# Altium schematic sheet [03] - 2560TK_Schematic.SchDoc
size A2; Organization: Altium Limited; Address1: L3, 12a Rodborough Rd; Address2: Frenchs Forest; Address3: NSW; Address4: Australia 2086
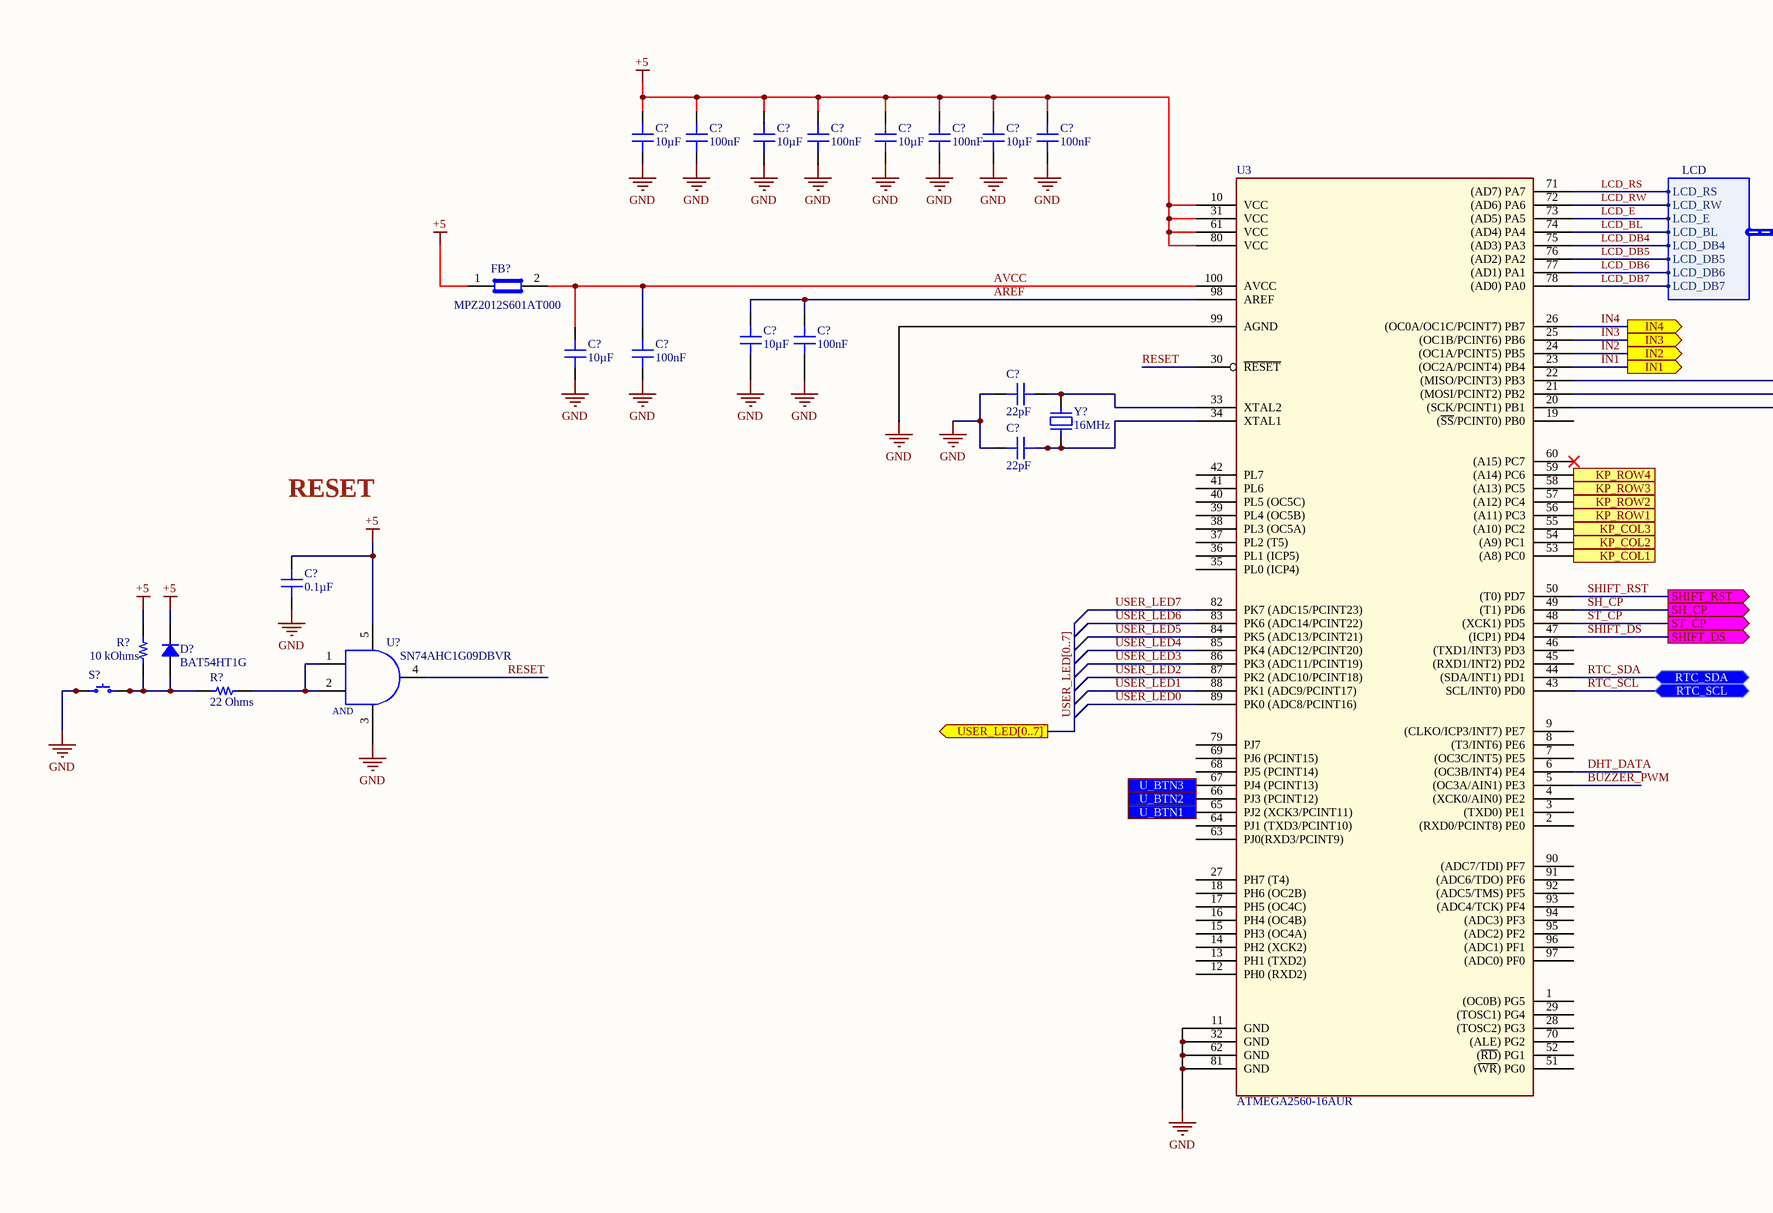
[diagram p0: [03] - 2560TK_Schematic.SchDoc, left]
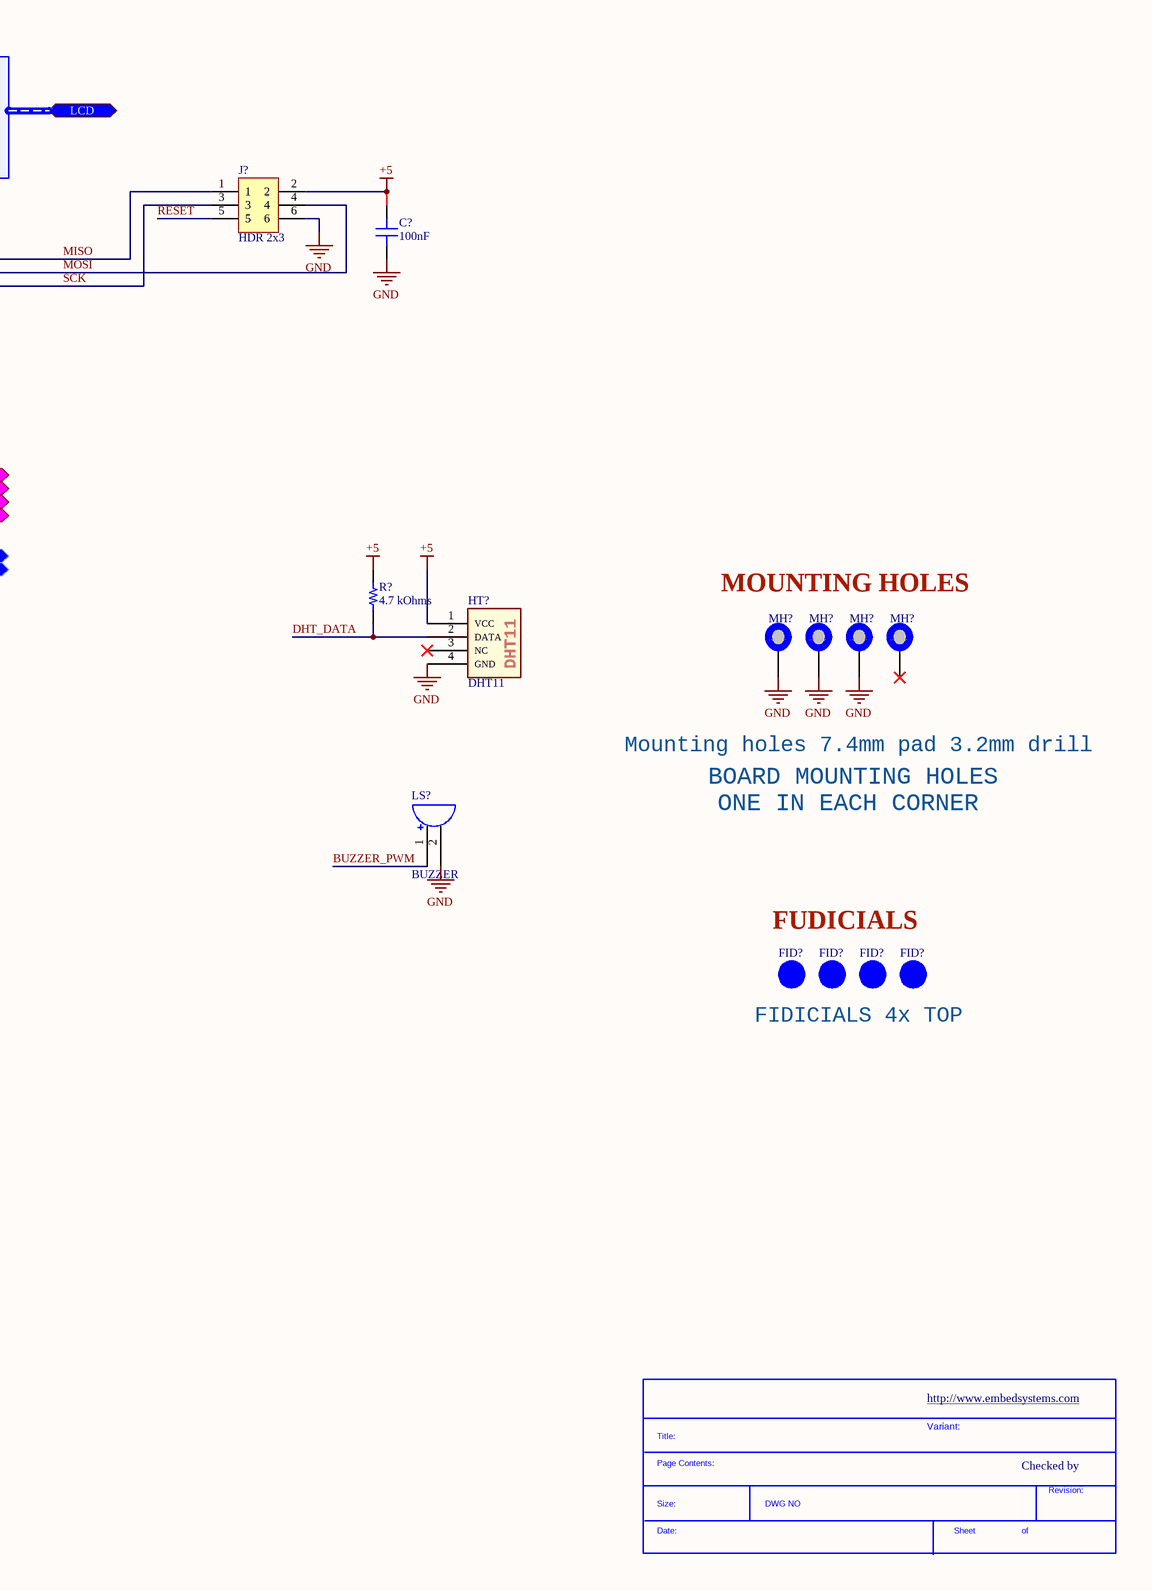
[diagram p1: [03] - 2560TK_Schematic.SchDoc, right]

## Parts
(Parts that share a designator on the sheet are numbered #1, #2 ... from top to bottom, then left to right.)
*?  SDTitleBlock  (value not drawn)  (graphical)
C?#1  10µF  [CAP 0805_2012]
C?#2  100nF  [CAP 0805_2012]
C?#3  10µF  [CAP 0805_2012]
C?#4  100nF  [CAP 0805_2012]
C?#5  10µF  [CAP 0805_2012]
C?#6  100nF  [CAP 0805_2012]
C?#7  10µF  [CAP 0805_2012]
C?#8  100nF  [CAP 0805_2012]
C?#9  10µF  [CAP 0805_2012]
C?#10  100nF  [CAP 0805_2012]
C?#11  10µF  [CAP 0805_2012]
C?#12  100nF  [CAP 0805_2012]
C?#13  100nF  [CAP 0805_2012]
C?#14  22pF  [CAP 0805_2012]
C?#15  22pF  [CAP 0805_2012]
C?#16  0.1µF  [CAP 0805_2012]
D?  BAT54HT1G  [SOD323]
FB?  MPZ2012S601AT000  [C0805]
FID?#1  FID_1MM  [FID_40x120]  (value not drawn)
FID?#2  FID_1MM  [FID_40x120]  (value not drawn)
FID?#3  FID_1MM  [FID_40x120]  (value not drawn)
FID?#4  FID_1MM  [FID_40x120]  (value not drawn)
HT?  DHT11  [DHT11]
J?  HDR 2x3  [HDR_2x3]
LS?  BUZZER  [BUZZER]
MH?#1  MH_7.4MMC_3.2MMD  [MH_7.4MMC_3.2MMD]  (value not drawn)
MH?#2  MH_7.4MMC_3.2MMD  [MH_7.4MMC_3.2MMD]  (value not drawn)
MH?#3  MH_7.4MMC_3.2MMD  [MH_7.4MMC_3.2MMD]  (value not drawn)
MH?#4  MH_7.4MMNC_3.2MMD  [MH_7.4MM_3.2MMD_NON_COPPER_NPTH]  (value not drawn)
R?#1  10 kOhms  [RES 0805_2012]
R?#2  22 Ohms  [RES 0805_2012]
R?#3  4.7 kOhms  [RES 0805_2012]
S?  PTS645SM43SMTR92 LFS  [C&K PTS645]  (value not drawn)
U3  ATMEGA2560-16AUR  [100pinTQFP]
U?  SN74AHC1G09DBVR  [DBV_SOP_23_5]
Y?  16MHz  [ABRACON ABLS]

## Ports
IN1 (out), IN2 (out), IN3 (out), IN4 (out), KP_COL1 (out), KP_COL2 (out), KP_COL3 (out), KP_ROW1 (in), KP_ROW2 (in), KP_ROW3 (in), KP_ROW4 (in), LCD (bidir, harness LCD), RTC_SCL (bidir), RTC_SDA (bidir), SH_CP (out), SHIFT_DS (out), SHIFT_RST (out), ST_CP (out), U_BTN1 (in), U_BTN2 (in), U_BTN3 (in), USER_LED[0..7] (out)

## Harnesses
LCD: LCD_RS, LCD_RW, LCD_E, LCD_BL, LCD_DB4, LCD_DB5, LCD_DB6, LCD_DB7

## Nets
+5: C?#1.2 C?#2.2 C?#3.2 C?#4.2 C?#5.2 C?#6.2 C?#7.2 C?#8.2 C?#13.2 C?#16.2 D?.2 FB?.1 HT?.1(VCC) J?.2 R?#1.2 R?#3.2 U3.10(VCC) U3.31(VCC) U3.61(VCC) U3.80(VCC) U?.5
GND: C?#1.1 C?#2.1 C?#3.1 C?#4.1 C?#5.1 C?#6.1 C?#7.1 C?#8.1 C?#9.1 C?#10.1 C?#11.1 C?#12.1 C?#13.1 C?#14.1 C?#15.1 C?#16.1 HT?.4(GND) J?.6 LS?.2 MH?#1.1 MH?#2.1 MH?#3.1 S?.1 S?.2 U3.11(GND) U3.32(GND) U3.62(GND) U3.81(GND) U3.99(AGND) U?.3
AREF: C?#9.2 C?#10.2 U3.98(AREF)
AVCC: C?#11.2 C?#12.2 FB?.2 U3.100(AVCC)
BUZZER_PWM: LS?.1 U3.5((OC3A/AIN1)_PE3)
DHT_DATA: HT?.2(DATA) R?#3.1 U3.6((OC3B/INT4)_PE4)
IN1: U3.23((OC2A/PCINT4)_PB4) ; port IN1
IN2: U3.24((OC1A/PCINT5)_PB5) ; port IN2
IN3: U3.25((OC1B/PCINT6)_PB6) ; port IN3
IN4: U3.26((OC0A/OC1C/PCINT7)_PB7) ; port IN4
KP_COL1: U3.53((A8)_PC0) ; port KP_COL1
KP_COL2: U3.54((A9)_PC1) ; port KP_COL2
KP_COL3: U3.55((A10)_PC2) ; port KP_COL3
KP_ROW1: U3.56((A11)_PC3) ; port KP_ROW1
KP_ROW2: U3.57((A12)_PC4) ; port KP_ROW2
KP_ROW3: U3.58((A13)_PC5) ; port KP_ROW3
KP_ROW4: U3.59((A14)_PC6) ; port KP_ROW4
LCD_BL: U3.74((AD4)_PA4) ; port LCD.LCD_BL
LCD_DB4: U3.75((AD3)_PA3) ; port LCD.LCD_DB4
LCD_DB5: U3.76((AD2)_PA2) ; port LCD.LCD_DB5
LCD_DB6: U3.77((AD1)_PA1) ; port LCD.LCD_DB6
LCD_DB7: U3.78((AD0)_PA0) ; port LCD.LCD_DB7
LCD_E: U3.73((AD5)_PA5) ; port LCD.LCD_E
LCD_RS: U3.71((AD7)_PA7) ; port LCD.LCD_RS
LCD_RW: U3.72((AD6)_PA6) ; port LCD.LCD_RW
MISO: J?.1 U3.22((MISO/PCINT3)_PB3)
MOSI: J?.4 U3.21((MOSI/PCINT2)_PB2)
RESET: J?.5 U3.30(~{RESET}) U?.4
RTC_SCL: U3.43(SCL/INT0)_PD0) ; port RTC_SCL
RTC_SDA: U3.44((SDA/INT1)_PD1) ; port RTC_SDA
SCK: J?.3 U3.20((SCK/PCINT1)_PB1)
SH_CP: U3.49((T1)_PD6) ; port SH_CP
SHIFT_DS: U3.47((ICP1)_PD4) ; port SHIFT_DS
SHIFT_RST: U3.50((T0)_PD7) ; port SHIFT_RST
ST_CP: U3.48((XCK1)_PD5) ; port ST_CP
U_BTN1: U3.65(PJ2_(XCK3/PCINT11)) ; port U_BTN1
U_BTN2: U3.66(PJ3_(PCINT12)) ; port U_BTN2
U_BTN3: U3.67(PJ4_(PCINT13)) ; port U_BTN3
USER_LED0: U3.89(PK0_(ADC8/PCINT16))
USER_LED1: U3.88(PK1_(ADC9/PCINT17))
USER_LED2: U3.87(PK2_(ADC10/PCINT18))
USER_LED3: U3.86(PK3_(ADC11/PCINT19))
USER_LED4: U3.85(PK4_(ADC12/PCINT20))
USER_LED5: U3.84(PK5_(ADC13/PCINT21))
USER_LED6: U3.83(PK6_(ADC14/PCINT22))
USER_LED7: U3.82(PK7_(ADC15/PCINT23))
NetC?#14_2: C?#14.2 U3.33(XTAL2) Y?.2
NetC?#15_2: C?#15.2 U3.34(XTAL1) Y?.1
NetD?_1: D?.1 R?#1.1 R?#2.1 S?.3 S?.4
NetR?#2_2: R?#2.2 U?.1 U?.2

Not connected (* = marked no-connect by the designer): HT? 3(NC)*; MH?#4 1*; U3 1((OC0B)_PG5) 2((RXD0/PCINT8)_PE0) 3((TXD0)_PE1) 4((XCK0/AIN0)_PE2) 7((OC3C/INT5)_PE5) 8((T3/INT6)_PE6) 9((CLKO/ICP3/INT7)_PE7) 12(PH0_(RXD2)) 13(PH1_(TXD2)) 14(PH2_(XCK2)) 15(PH3_(OC4A)) 16(PH4_(OC4B)) 17(PH5_(OC4C)) 18(PH6_(OC2B)) 19((~{SS}/PCINT0)_PB0) 27(PH7_(T4)) 28((TOSC2)_PG3) 29((TOSC1)_PG4) 35(PL0_(ICP4)) 36(PL1_(ICP5)) 37(PL2_(T5)) 38(PL3_(OC5A)) 39(PL4_(OC5B)) 40(PL5_(OC5C)) 41(PL6) 42(PL7) 45((RXD1/INT2)_PD2) 46((TXD1/INT3)_PD3) 51((~{WR})_PG0) 52((~{RD})_PG1) 60((A15)_PC7)* 63(PJ0(RXD3/PCINT9)) 64(PJ1_(TXD3/PCINT10)) 68(PJ5_(PCINT14)) 69(PJ6_(PCINT15)) 70((ALE)_PG2) 79(PJ7) 90((ADC7/TDI)_PF7) 91((ADC6/TDO)_PF6) 92((ADC5/TMS)_PF5) 93((ADC4/TCK)_PF4) 94((ADC3)_PF3) 95((ADC2)_PF2) 96((ADC1)_PF1) 97((ADC0)_PF0)

## Buses and harness runs
bus USER_LED[0..7] = port USER_LED[0..7]

## Notes on the sheet
- RESET
- (near MH?#1) MOUNTING HOLES
- Mounting holes 7.4mm pad 3.2mm drill
- ONE IN EACH CORNER
- BOARD MOUNTING HOLES
- (near FID?#1) FUDICIALS
- (near FID?#1) FIDICIALS 4x TOP
- http://www.embedsystems.com
- Variant:
- Checked by
- Title
- Size:
- Date:
- File:
- A2
- Number:
- Time:
- Revision:
- Sheet
- of
- (in symbol SDTitleBlock) Title:; Page Contents:; Revision:; Size:; DWG NO; Date:; Sheet; of
- (in symbol SN74AHC1G09DBVR) AND

## Library data of the parts
C?#1 C?#3 C?#5 C?#7 C?#9 C?#11 = 0805BW106K160NGT: CAP CER 10UF 16V X5R 0805; Manufacturer: Knowles Novacap; Tolerance: ±10%; Part Number: 0805BW106K160NGT; Value: 10µF; Applications: General Purpose; Capacitance: 10µF; ComponentLink1Description: Datasheet; ComponentLink1URL: https://www.knowlescapacitors.com/getattachment/6c8d48ef-fc2b-4752-ae2c-ce6c208de0c4/High-Capacitance-Chip.aspx; ComponentLink2Description: DigiKey Link; ComponentLink2URL: http://digikey.com/product-detail/en/knowles-novacap/0805BW106K160NGT/1763-1170-1-ND/7303990; Device Package: 0805 (2012 Metric); Features: Gold Flash Termination; LastUpdated: 02/09/2020 01:04:27; Lifecycle Status: Active; Minimum Order: 1; Mounting Type: Surface Mount, MLCC; Operating Temperature: -55°C ~ 85°C; Package / Case: 0805 (2012 Metric); Packaging: TapeAndReel; PartId: 10571; Part Status: Active; Price: 1.32; Series: -; Size / Dimension: 0.080" L x 0.050" W (2.03mm x 1.27mm); Supplier 1: DigiKey; Supplier Part Number 1: 1763-1170-1-ND; Temperature Coefficient: X5R; Thickness (Max): 0.054" (1.37mm); Voltage - Rated: 16V
C?#2 C?#4 C?#6 C?#8 C?#10 C?#12 C?#13 = AC0805KKX8R9BB104: CAP CER 0805 10% X8R 50V 100NF; Manufacturer: Yageo; Capacitance: 0.1µF; Part Number: AC0805KKX8R9BB104; Value: 100nF; Applications: Automotive; ComponentLink1Description: Datasheet; ComponentLink1URL: http://www.yageo.com/documents/recent/AC0805KKX8R9BB104.pdf; ComponentLink2Description: DigiKey Link; ComponentLink2URL: http://digikey.com/product-detail/en/yageo/AC0805KKX8R9BB104/311-4624-1-ND/9699550; Device Package: 0805 (2012 Metric); LastUpdated: 02/09/2020 01:04:20; Lifecycle Status: Active; Minimum Order: 1; Mounting Type: Surface Mount, MLCC; Operating Temperature: -55°C ~ 150°C; Package / Case: 0805 (2012 Metric); Packaging: TapeAndReel; PartId: 14076; Part Status: Active; Price: 0.06; Ratings: AEC-Q200; Series: AC; Size / Dimension: 0.079" L x 0.049" W (2.00mm x 1.25mm); Supplier 1: DigiKey; Supplier Part Number 1: 311-4624-1-ND; Temperature Coefficient: X8R; Thickness (Max): 0.057" (1.45mm); Tolerance: ±10%; Voltage - Rated: 50V
C?#14 C?#15 = 08051A220GAT2A: CAP CER 22PF 100V C0G/NP0 0805; Manufacturer: AVX Corporation; Temperature Coefficient: C0G, NP0; Tolerance: ±2%; Part Number: 08051A220GAT2A; Value: 22pF; Applications: General Purpose; Capacitance: 22pF; ComponentLink1Description: Datasheet; ComponentLink1URL: http://datasheets.avx.com/C0GNP0-Dielectric.pdf; ComponentLink2Description: DigiKey Link; ComponentLink2URL: http://digikey.com/product-detail/en/avx-corporation/08051A220GAT2A/478-10819-1-ND/7536356; Device Package: 0805 (2012 Metric); LastUpdated: 02/09/2020 01:04:39; Lifecycle Status: Active; Minimum Order: 1; Mounting Type: Surface Mount, MLCC; Operating Temperature: -55°C ~ 125°C; Package / Case: 0805 (2012 Metric); Packaging: TapeAndReel; PartId: 3991; Part Status: Active; Price: 0.10; Series: -; Size / Dimension: 0.079" L x 0.049" W (2.01mm x 1.25mm); Supplier 1: DigiKey; Supplier Part Number 1: 478-10819-1-ND; Thickness (Max): 0.037" (0.94mm); Voltage - Rated: 100V
C?#16 = AC0805KKX8R9BB104: CAP CER 0805 10% X8R 50V 100NF; Manufacturer: Yageo; Part Number: AC0805KKX8R9BB104; Value: 0.1µF; Applications: Automotive; Capacitance: 0.1µF; ComponentLink1Description: Datasheet; ComponentLink1URL: http://www.yageo.com/documents/recent/AC0805KKX8R9BB104.pdf; ComponentLink2Description: DigiKey Link; ComponentLink2URL: http://digikey.com/product-detail/en/yageo/AC0805KKX8R9BB104/311-4624-1-ND/9699550; Device Package: 0805 (2012 Metric); LastUpdated: 02/09/2020 01:04:20; Lifecycle Status: Active; Minimum Order: 1; Mounting Type: Surface Mount, MLCC; Operating Temperature: -55°C ~ 150°C; Package / Case: 0805 (2012 Metric); Packaging: TapeAndReel; PartId: 14076; Part Status: Active; Price: 0.06; Ratings: AEC-Q200; Series: AC; Size / Dimension: 0.079" L x 0.049" W (2.00mm x 1.25mm); Supplier 1: DigiKey; Supplier Part Number 1: 311-4624-1-ND; Temperature Coefficient: X8R; Thickness (Max): 0.057" (1.45mm); Tolerance: ±10%; Voltage - Rated: 50V
D? = BAT54HT1G: DIODE SCHOTTKY 30V 200MA SOD323; Manufacturer: ON Semiconductor; Capacitance @ Vr, F: 10pF @ 1V, 1MHz; Current - Average Rectified (Io): 200mA (DC); Current - Reverse Leakage @ Vr: 2µA @ 25V; Reverse Recovery Time (trr): 5ns; Speed: Small Signal =< 200mA (Io), Any Speed; Voltage - Forward (Vf) (Max) @ If: 800mV @ 100mA; Part Number: BAT54HT1G; ComponentLink1Description: Datasheet; ComponentLink1URL: //media.digikey.com/pdf/Data%20Sheets/Fairchild%20PDFs/BAT54HT1G_Rev_1.2.pdf; ComponentLink2Description: DigiKey Link; ComponentLink2URL: http://digikey.com/product-detail/en/on-semiconductor/BAT54HT1G/BAT54HT1GOSCT-ND/917809; Diode Type: Schottky; LastUpdated: 02/09/2020 01:27:26; Lifecycle Status: Active; Minimum Order: 1; Mounting Type: Surface Mount; Operating Temperature - Junction: -55°C ~ 150°C; Package / Case: SC-76, SOD-323; Packaging: TapeAndReel; PartId: 3080; Part Status: Active; Price: 0.03; Supplier 1: DigiKey; Supplier Part Number 1: BAT54HT1GOSCT-ND; Supplier Device Package: SOD-323; Voltage - DC Reverse (Vr) (Max): 30V
FB? = MPZ2012S601AT000: FERRITE BEAD 600 OHM 0805 1LN; Manufacturer: TDK; Impedance: 600R; Current Rating: 2A; DC Resistance (DCR): 100mR; Supplier 1: Digi-Key; Manufacturer Part Number: MPZ2012S601AT000; RoHS: Yes; Category: Ferrite Beads and Chips; Stock 1: 209203; Pricing 1: 1=0.11000, 10=0.09200, 25=0.08240, 50=0.06040, 100=0.05220, 250=0.04116, 500=0.03476, 1000=0.02928 (USD); Mount: Surface Mount; Case/Package: 0805; Case Code (Metric): 2012; Case Code (Imperial): 0805; Packaging: Tape and Reel; Package Quantity: 1; Max DC Current: 2A; Series: MPZ; Length: 0.079inch; Width: 0.049inch; Height: 0.041inch; REACH SVHC: No SVHC; Lead Free: Lead Free; RoHS Compliant: Yes; ComponentLink1URL: https://datasheet.ciiva.com/46634/beads-commercial-power-mpz-en-46634377.pdf?src-supplier=Digi-Key; ComponentLink1Description: https://datasheet.ciiva.com/46634/beads-commercial-power-mpz-en-46634377.pdf?src-supplier=Digi-Key; ComponentLink2URL: https://datasheet.ciiva.com/46634/beads-commercial-power-mpz-en-46634606.pdf?src-supplier=Digi-Key; ComponentLink2Description: https://datasheet.ciiva.com/46634/beads-commercial-power-mpz-en-46634606.pdf?src-supplier=Digi-Key; ComponentLink3URL: https://datasheet.ciiva.com/46634/beads-commercial-power-mpz-en-46634335.pdf?src-supplier=Digi-Key; ComponentLink3Description: https://datasheet.ciiva.com/46634/beads-commercial-power-mpz-en-46634335.pdf?src-supplier=Digi-Key; Supplier Part Number 1: 445-2206-1-ND
FID?#1-FID?#4 = FID_1MM: Fiducial 40mil Diameter, 120mil mask
HT? = DHT11: SENSOR HUMID/TEMP 5V DTL 5% MOD; Manufacturer: Adafruit Industries; Manufacturer Part Number: 386; Response Time: 1s; Sensor Type: Temperature; Output Type: Digital; RoHS: Yes; Category: Optoelectronics; Stock 1: 753; Pricing 1: 1=5.00000 (USD); Mount: Chassis Mount; Min Operating Temperature: 0°C; Max Operating Temperature: 50°C; Accuracy: 5%; ComponentLink1URL: https://media.digikey.com/pdf/Data%20Sheets/Adafruit%20PDFs/DHT11_ProdManual.pdf?src-supplier=Digi-Key; ComponentLink1Description: https://media.digikey.com/pdf/Data%20Sheets/Adafruit%20PDFs/DHT11_ProdManual.pdf?src-supplier=Digi-Key; Supplier 1: Digi-Key; Supplier Part Number 1: 1528-1228-ND
J? = HDR 2x3: CONN HEADER 6POS .100 STR 30AU; Manufacturer: Amphenol FCI; Manufacturer Part Number: 67997-106HLF; Number of Contacts: 6; Current Rating: 3A; Voltage Rating: 1.5kV; Insulation Resistance: 5GR; Gender: Male; Connector Type: Male Pin; Pitch: 2.54mm; Row Spacing: 0.1inch; Contact Post Length: 3.05mm; Supplier 1: Digi-Key; RoHS: Yes; Category: Headers and Wire Housings; Stock 1: 1173; Pricing 1: 1=1.87000, 10=1.69500, 100=1.45300, 500=1.21082, 1000=1.03785, 5000=0.92023, 10000=0.89947 (USD); Mount: Through Hole; Contact Plating: Gold,GXT; Contact Material: Bronze; Color: Black; Housing Color: Black; Housing Material: Thermoplastic; Min Operating Temperature: -65°C; Max Operating Temperature: 125°C; Number of Rows: 2; Termination: Through Hole; Packaging: Bulk; Package Quantity: 100; Contact Gender: Male; Number of Positions: 6; Max Voltage Rating (AC): 1.5kV; Orientation: Straight; Series: 67997; Contact Type: Male Pin; Length: 7.62mm; Contact Mating Length: 0.23inch; Depth: 4.83mm; Radiation Hardening: No; REACH SVHC: No SVHC; Lead Free: Lead Free; Flammability Rating: UL94 V-0; RoHS Compliant: Yes; ComponentLink1URL: https://datasheet.ciiva.com/5153/67996-222463-5153820.pdf?src-supplier=Mouser; ComponentLink1Description: https://datasheet.ciiva.com/5153/67996-222463-5153820.pdf?src-supplier=Mouser; ComponentLink2URL: https://datasheet.ciiva.com/16726/67996-16726286.pdf?src-supplier=Avnet+Europe; ComponentLink2Description: https://datasheet.ciiva.com/16726/67996-16726286.pdf?src-supplier=Avnet+Europe; ComponentLink3URL: https://datasheet.ciiva.com/722/67996-722044.pdf?src-supplier=Digi-Key; ComponentLink3Description: https://datasheet.ciiva.com/722/67996-722044.pdf?src-supplier=Digi-Key; ComponentLink4URL: https://datasheet.ciiva.com/10149/67996-10149221.pdf?src-supplier=Avnet; ComponentLink4Description: https://datasheet.ciiva.com/10149/67996-10149221.pdf?src-supplier=Avnet; ComponentLink5URL: https://datasheet.ciiva.com/46393/1876884-46393067.pdf?src-supplier=Element14; ComponentLink5Description: https://datasheet.ciiva.com/46393/1876884-46393067.pdf?src-supplier=Element14; Supplier Part Number 1: 609-3393-ND
LS? = BUZZER: AUDIO MAGNETIC XDCR 3-7V TH; Manufacturer: Projects Unlimited; Manufacturer Part Number: AT-1224-TWT-5V-2-R; Voltage Rating: 5V; Frequency: 2.4kHz; Operating Supply Current: 40mA; RoHS: Yes; Category: Audio Products; Stock 1: 83564; Pricing 1: 1=0.61000, 5=0.54600, 10=0.52000, 25=0.48640, 50=0.46120, 100=0.43680, 500=0.38252, 1000=0.36032, 5000=0.31168 (USD); Mount: Through Hole; Contact Plating: Tin; Min Operating Temperature: -30°C; Max Operating Temperature: 70°C; Packaging: Tray; Termination: PC Pins; Sensing Method: Magnetic; Max Supply Current: 40mA; Diameter: 12mm; Height: 9mm; ComponentLink1URL: http://www.mouser.com/ds/2/334/AT-1224-TWT-5V-2-R-532234.pdf?src-supplier=Mouser; ComponentLink1Description: http://www.mouser.com/ds/2/334/AT-1224-TWT-5V-2-R-532234.pdf?src-supplier=Mouser; ComponentLink2URL: http://www.puiaudio.com/pdf/AT-1224-TWT-5V-2-R.pdf?src-supplier=Digi-Key; ComponentLink2Description: http://www.puiaudio.com/pdf/AT-1224-TWT-5V-2-R.pdf?src-supplier=Digi-Key; ComponentLink3URL: http://www.puiaudio.com/pdf/AT-1224-TWT-5V-2-R.pdf?src-supplier=Avnet; ComponentLink3Description: http://www.puiaudio.com/pdf/AT-1224-TWT-5V-2-R.pdf?src-supplier=Avnet; Supplier 1: Digi-Key; Supplier Part Number 1: 668-1470-ND
MH?#1-MH?#3 = MH_7.4MMC_3.2MMD: Mounting Hole 7.4mm Diameter, 3.2mm Dril
MH?#4 = MH_7.4MMNC_3.2MMD: Mounting Hole 7.4mm Diameter (Non Copper), 3.2mm Dril NPTH
R?#1 = RT0805DRD0710KL: RES SMD 10K OHM 0.5% 1/8W 0805; Manufacturer: Yageo; Power (Watts): 0.125W, 1/8W; Temperature Coefficient: ±25ppm/°C; Part Number: RT0805DRD0710KL; Value: 10 kOhms; ComponentLink1Description: Datasheet; ComponentLink1URL: https://www.yageo.com/upload/media/product/productsearch/datasheet/rchip/PYu-RT_1-to-0.01_RoHS_L_11.pdf; ComponentLink2Description: DigiKey Link; ComponentLink2URL: http://digikey.com/product-detail/en/yageo/RT0805DRD0710KL/311-2699-1-ND/6129118; Composition: Thin Film; Device Package: 0805 (2012 Metric); Height - Seated (Max): 0.024" (0.60mm); LastUpdated: 02/09/2020 01:15:24; Lifecycle Status: Active; Minimum Order: 1; Number of Terminations: 2; Operating Temperature: -55°C ~ 155°C; Package / Case: 0805 (2012 Metric); Packaging: TapeAndReel; PartId: 27797; Part Status: Active; Price: 0.03; Resistance: 10 kOhms; Series: RT; Size / Dimension: 0.079" L x 0.049" W (2.00mm x 1.25mm); Supplier 1: DigiKey; Supplier Part Number 1: 311-2699-1-ND; Supplier Device Package: 0805; Tolerance: ±0.5%
R?#2 = RC0805JR-0722RL: RES SMD 22 OHM 5% 1/8W 0805; Manufacturer: Yageo; Power (Watts): 0.125W, 1/8W; Temperature Coefficient: ±100ppm/°C; Part Number: RC0805JR-0722RL; Value: 22 Ohms; ComponentLink1Description: Datasheet; ComponentLink1URL: https://www.yageo.com/upload/media/product/productsearch/datasheet/rchip/PYu-RC_Group_51_RoHS_L_10.pdf; ComponentLink2Description: DigiKey Link; ComponentLink2URL: http://digikey.com/product-detail/en/yageo/RC0805JR-0722RL/311-22ARCT-ND/731232; Composition: Thick Film; Device Package: 0805 (2012 Metric); Features: Moisture Resistant; Height - Seated (Max): 0.024" (0.60mm); LastUpdated: 02/09/2020 01:14:53; Lifecycle Status: Active; Minimum Order: 1; Number of Terminations: 2; Operating Temperature: -55°C ~ 155°C; Package / Case: 0805 (2012 Metric); Packaging: CutTape; PartId: 41770; Part Status: Active; Price: 0.10; Resistance: 22 Ohms; Series: RC; Size / Dimension: 0.079" L x 0.049" W (2.00mm x 1.25mm); Supplier 1: DigiKey; Supplier Part Number 1: 311-22ARCT-ND; Supplier Device Package: 0805; Tolerance: ±5%
R?#3 = RC0805FR-074K7P: RES SMD 4.7K OHM 1% 1/8W 0805; Manufacturer: Yageo; Power (Watts): 0.125W, 1/8W; Temperature Coefficient: ±100ppm/°C; Part Number: RC0805FR-074K7P; Value: 4.7 kOhms; ComponentLink1Description: Datasheet; ComponentLink1URL: http://www.yageo.com/NewPortal/yageodocoutput?fileName=/pdf/R-Chip/PYu-RC_51_RoHS_P_0.pdf; ComponentLink2Description: DigiKey Link; ComponentLink2URL: http://digikey.com/product-detail/en/yageo/RC0805FR-074K7P/YAG1325CT-ND/4935438; Composition: Thick Film; Device Package: 0805 (2012 Metric); Features: Moisture Resistant; Height - Seated (Max): 0.024" (0.60mm); LastUpdated: 02/09/2020 01:15:24; Lifecycle Status: Active; Minimum Order: 1; Number of Terminations: 2; Operating Temperature: -55°C ~ 155°C; Package / Case: 0805 (2012 Metric); Packaging: TapeAndReel; PartId: 27895; Part Status: Active; Price: 0.01; Resistance: 4.7 kOhms; Series: RC-P Lead Free; Size / Dimension: 0.079" L x 0.049" W (2.00mm x 1.25mm); Supplier 1: DigiKey; Supplier Part Number 1: YAG1325CT-ND; Supplier Device Package: 0805; Tolerance: ±1%
S? = PTS645SM43SMTR92 LFS: SWITCH TACTILE SPST-NO 0.05A 12V; Manufacturer: C&K; Actuator Height off PCB, Vertical: 4.30mm; Actuator Orientation: Top Actuated; Actuator Type: Standard; Contact Rating @ Voltage: 0.05A @ 12VDC; Illumination: Non-Illuminated; Operating Force: 160gf; Outline: 6.00mm x 6.00mm; Switch Function: Off-Mom; Part Number: PTS645SM43SMTR92 LFS; Circuit: SPST-NO; ComponentLink1Description: Datasheet; ComponentLink1URL: https://dznh3ojzb2azq.cloudfront.net/products/Tactile/PTS645/documents/datasheet.pdf; ComponentLink2Description: DigiKey Link; ComponentLink2URL: http://digikey.com/product-detail/en/c-k/PTS645SM43SMTR92-LFS/CKN9112CT-ND/1146934; Features: Blue Actuator; LastUpdated: 09/04/2020 09:59:00; Lifecycle Status: Active; Minimum Order: 1; Mounting Type: Surface Mount; Operating Temperature: -20°C ~ 60°C; Packaging: TapeAndReel; Part Status: Active; Price: 0.09; Series: PTS645; Supplier 1: DigiKey; Supplier Part Number 1: CKN9112CT-ND; Termination Style: Gull Wing
U3 = ATMEGA2560-16AUR: ATMEGA2560 IC MCU 8BIT 256KB FLASH 100TQFP; Manufacturer: Microchip / Atmel; RAM Size: 8KB; Interface: I2C,SPI,UART,USART,EBI/EMI; Number of I/Os: 86; Number of Timers/Counters: 6; Frequency: 16MHz; Operating Supply Voltage: 5V; Max Supply Voltage: 5.5V; Min Supply Voltage: 4.5V; Oscillator Type: Internal; Data Bus Width: 8b; Watchdog Timer: Yes; Peripherals: Brown-out Detect/Reset,POR,PWM,WDT; Core Architecture: AVR; Supplier 1: Digi-Key; Manufacturer Part Number: ATMEGA2560-16AUR; RoHS: Yes; Category: Microcontrollers; Stock 1: 900; Pricing 1: 1=11.99000, 25=10.99000, 100=9.95010 (USD); Mount: Surface Mount; Case/Package: A; Number of Pins: 100; Contact Plating: Tin,Matte; Min Operating Temperature: -40°C; Max Operating Temperature: 85°C; Package Quantity: 1500; Packaging: Tape and Reel; Number of Programmable I/O: 86; Max Frequency: 16MHz; Memory Type: FLASH; Memory Size: 256KB; REACH SVHC: No SVHC; Lead Free: Lead Free; ComponentLink1URL: https://datasheet.ciiva.com/6641/atmel-2549-8-bit-avr-microcontroller-atmega640-1280-1281-2560-2561-summary-6641242.pdf?src-supplier=Digi-Key; ComponentLink1Description: https://datasheet.ciiva.com/6641/atmel-2549-8-bit-avr-microcontroller-atmega640-1280-1281-2560-2561-summary-6641242.pdf?src-supplier=Digi-Key; ComponentLink2URL: https://datasheet.ciiva.com/6641/atmel-2549-8-bit-avr-microcontroller-atmega640-1280-1281-2560-2561-summary-6641243.pdf?src-supplier=Digi-Key; ComponentLink2Description: https://datasheet.ciiva.com/6641/atmel-2549-8-bit-avr-microcontroller-atmega640-1280-1281-2560-2561-summary-6641243.pdf?src-supplier=Digi-Key; ComponentLink3URL: https://datasheet.ciiva.com/6641/atmel-2549-8-bit-avr-microcontroller-atmega640-1280-1281-2560-2561-summary-6641244.pdf?src-supplier=Digi-Key; ComponentLink3Description: https://datasheet.ciiva.com/6641/atmel-2549-8-bit-avr-microcontroller-atmega640-1280-1281-2560-2561-summary-6641244.pdf?src-supplier=Digi-Key; Supplier Part Number 1: ATMEGA2560-16AURCT-ND
U? = SN74AHC1G09DBVR: TEXAS INSTRUMENTS - SN74AHC1G09DBVR - AND Gate, 74AHC1G09, 2 Input, 2 V to 5.5 V, SOT-23-5; Min Supply Voltage: 2V; Max Supply Voltage: 5.5V; Quiescent Current: 1uA; Number of Inputs: 2; Propagation Delay: 7.5ns; Output Current: 25mA; Number of Circuits: 1; Low Level Output Current: 8mA; Supplier 1: Digi-Key; Manufacturer: Texas Instruments; Manufacturer Part Number: SN74AHC1G09DBVR; RoHS: Yes; Category: Logic Gates; Stock 1: 8299; Pricing 1: 1=0.36000, 10=0.27100, 25=0.23760, 100=0.15370, 250=0.12720, 500=0.10176, 1000=0.07802 (USD); Mount: Surface Mount; Case/Package: SOT-23; Number of Pins: 5; Contact Plating: Tin,Matte; Min Operating Temperature: -55°C; Max Operating Temperature: 125°C; Logic Function: AND GATE; Package Quantity: 3000; Packaging: Tape and Reel; Number of Gates: 1; Number of Elements: 1; Number of Bits: 1; Series: 74AHC; Technology: CMOS; Output Voltage: 5.5V; Number of Outputs: 1; Radiation Hardening: No; REACH SVHC: No SVHC; Lead Free: Lead Free; RoHS Compliant: Yes; ComponentLink1URL: https://datasheet.ciiva.com/1864/sn74ahc1g09-1864410.pdf?src-supplier=Digi-Key; ComponentLink1Description: https://datasheet.ciiva.com/1864/sn74ahc1g09-1864410.pdf?src-supplier=Digi-Key; ComponentLink2URL: https://datasheet.ciiva.com/1864/sn74ahc1g09-1864411.pdf?src-supplier=Digi-Key; ComponentLink2Description: https://datasheet.ciiva.com/1864/sn74ahc1g09-1864411.pdf?src-supplier=Digi-Key; ComponentLink3URL: https://datasheet.ciiva.com/1864/sn74ahc1g09-1864412.pdf?src-supplier=Digi-Key; ComponentLink3Description: https://datasheet.ciiva.com/1864/sn74ahc1g09-1864412.pdf?src-supplier=Digi-Key; Supplier Part Number 1: 296-29202-1-ND
Y? = ABLS-16.000MHZ-16-A-4-H-T: CRYSTAL 16.0000MHZ 16PF SMD; Manufacturer: Abracon LLC; ESR (Equivalent Series Resistance): 40 Ohms; Frequency Stability: ±35ppm; Frequency Tolerance: ±30ppm; Operating Mode: Fundamental; Part Number: ABLS-16.000MHZ-16-A-4-H-T; ComponentLink1Description: Datasheet; ComponentLink1URL: https://abracon.com/Resonators/abls.pdf; ComponentLink2Description: DigiKey Link; ComponentLink2URL: http://digikey.com/product-detail/en/abracon-llc/ABLS-16.000MHZ-16-A-4-H-T/535-14880-1-ND/9997957; Frequency: 16MHz; Height - Seated (Max): 0.165" (4.20mm); LastUpdated: 02/09/2020 01:21:46; Lifecycle Status: Active; Load Capacitance: 16pF; Minimum Order: 1; Mounting Type: Surface Mount; Operating Temperature: -10°C ~ 60°C; Package / Case: HC-49/US; Packaging: TapeAndReel; PartId: 68; Part Status: Active; Price: 0.12; Series: ABLS; Size / Dimension: 0.449" L x 0.185" W (11.40mm x 4.70mm); Supplier 1: DigiKey; Supplier Part Number 1: 535-14880-1-ND; Type: MHz Crystal; Value: 16MHz